# EAGLE design main_board_without_pads (EAGLE 9.5.1)
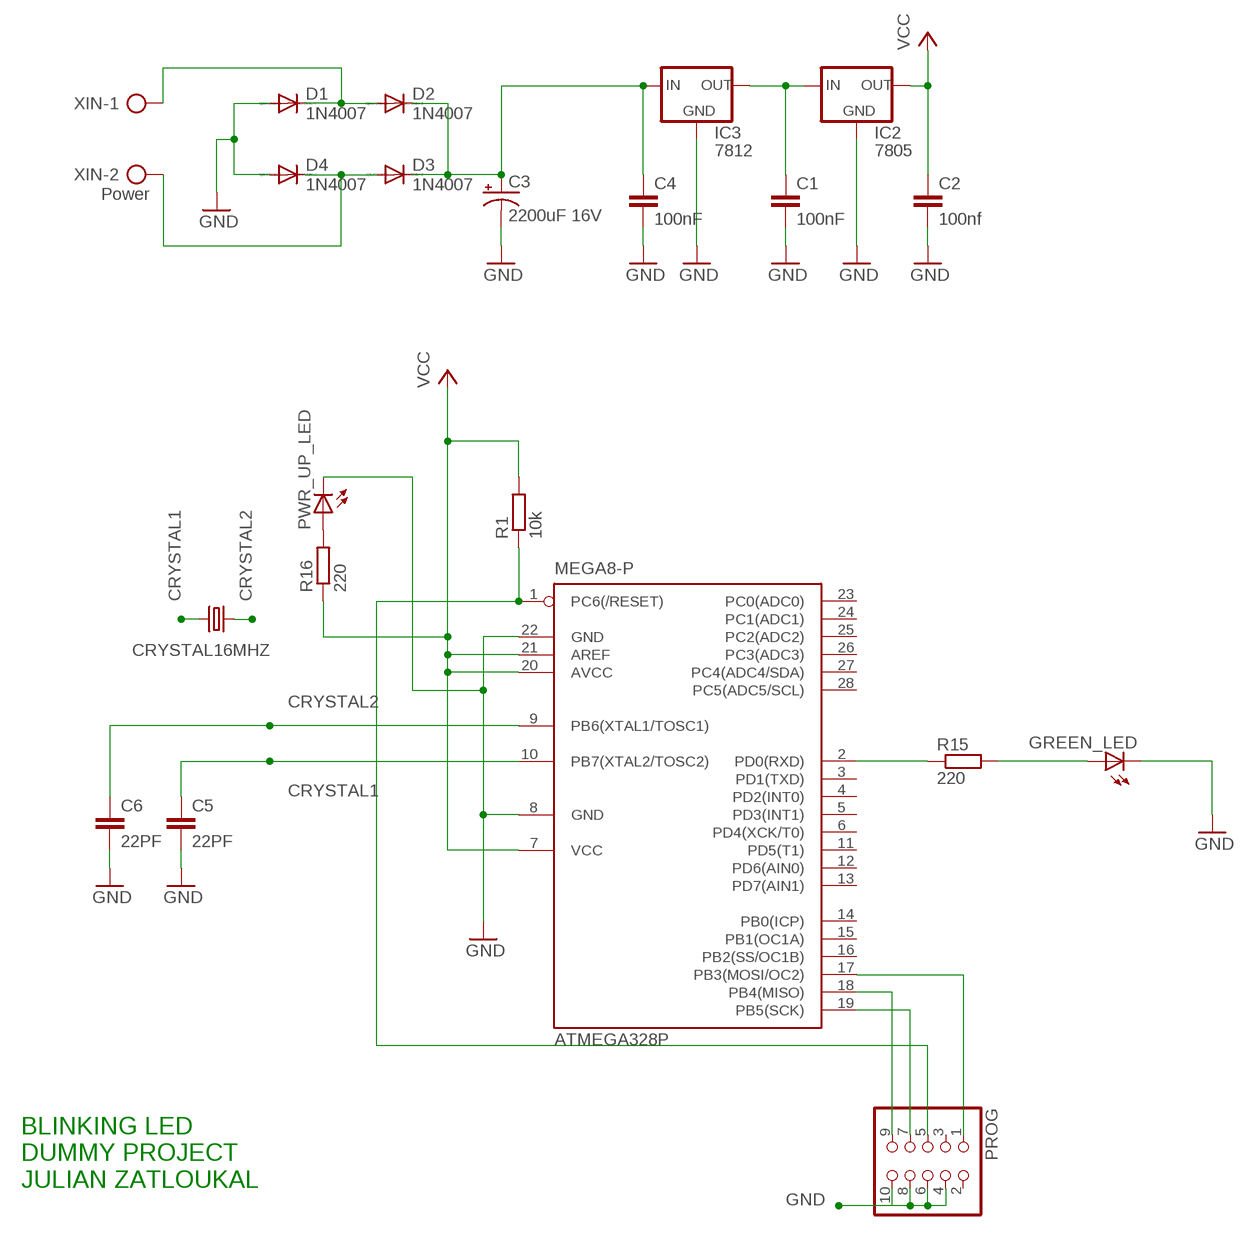
[diagram p0: schematic, sheet 1]

## Parts
ATMEGA328P  MEGA8-P  [DIL28-3]
C1  100nF  C-EU050-025X075  [C050-025X075]
C2  100nf  C-EU050-025X075  [C050-025X075]
C3  2200uF 16V  CPOL-USE7.5-16  [E7,5-16]
C4  100nF  C-EU050-025X075  [C050-025X075]
C5  22PF  C-EU050-024X044  [C050-024X044]
C6  22PF  C-EU050-024X044  [C050-024X044]
CRYSTAL16MHZ  CRYSTALHC49S  [HC49/S]
D1  1N4007  1N4004  [DO41-10]
D2  1N4007  1N4004  [DO41-10]
D3  1N4007  1N4004  [DO41-10]
D4  1N4007  1N4004  [DO41-10]
GREEN_LED  LED5MM  [LED5MM]
IC2  7805  78XXL  [78XXL]
IC3  7812  78XXL  [78XXL]
PROG  PINHD-2X5  [2X05]
PWR_UP_LED  LED5MM  [LED5MM]
R1  10k  R-EU_0207/10  [0207/10]
R15  220  R-EU_0207/10  [0207/10]
R16  220  R-EU_0207/10  [0207/10]
XIN  Power  AK500/2  [AK500/2]

## Nets
+12V: C1.1 IC2.IN IC3.OUT
CRYSTAL1: ATMEGA328P.10(PB7(XTAL2/TOSC2)) C5.1 CRYSTAL16MHZ.2
CRYSTAL2: ATMEGA328P.9(PB6(XTAL1/TOSC1)) C6.1 CRYSTAL16MHZ.1
GND: ATMEGA328P.8(GND) ATMEGA328P.22(GND) C1.2 C2.2 C3.- C4.2 C5.2 C6.2 D1.A D4.A GREEN_LED.K(C) IC2.GND IC3.GND PROG.4 PROG.6 PROG.8 PROG.10 PWR_UP_LED.K(C)
N$1: ATMEGA328P.1(PC6(/RESET)) PROG.5 R1.1
N$2: ATMEGA328P.2(PD0(RXD)) R15.1
N$16: ATMEGA328P.17(PB3(MOSI/OC2)) PROG.1
N$17: PWR_UP_LED.A R16.2
N$18: ATMEGA328P.19(PB5(SCK)) PROG.7
N$19: ATMEGA328P.18(PB4(MISO)) PROG.9
N$22: C3.+ C4.1 D2.C D3.C IC3.IN
N$24: D1.C D2.A XIN.1
N$65: D3.A D4.C XIN.2
N$153: GREEN_LED.A R15.2
VCC: ATMEGA328P.7(VCC) ATMEGA328P.20(AVCC) ATMEGA328P.21(AREF) C2.1 IC2.OUT R1.2 R16.1
Unconnected: ATMEGA328P.3(PD1(TXD)) ATMEGA328P.4(PD2(INT0)) ATMEGA328P.5(PD3(INT1)) ATMEGA328P.6(PD4(XCK/T0)) ATMEGA328P.11(PD5(T1)) ATMEGA328P.12(PD6(AIN0)) ATMEGA328P.13(PD7(AIN1)) ATMEGA328P.14(PB0(ICP)) ATMEGA328P.15(PB1(OC1A)) ATMEGA328P.16(PB2(SS/OC1B)) ATMEGA328P.23(PC0(ADC0)) ATMEGA328P.24(PC1(ADC1)) ATMEGA328P.25(PC2(ADC2)) ATMEGA328P.26(PC3(ADC3)) ATMEGA328P.27(PC4(ADC4/SDA)) ATMEGA328P.28(PC5(ADC5/SCL)) PROG.2 PROG.3

## Notes on the sheet
- BLINKING LED
  DUMMY PROJECT
  JULIAN ZATLOUKAL

## Library data of the parts
ATMEGA328P = atmel:MEGA8-P: MICROCONTROLLER 8 Kbytes FLASH, 1 kbytes SRAM, 512 bytes EEPROM, USART, 4-channel 10 bit ADC, 2-channel 8 bit ADC Pin compatible with Atmega48, ATMega88, ATMega168 Source: avr.lbr; OC_FARNELL: unknown; OC_NEWARK: unknown
C1 C2 C4-C6 = rcl:C-EU: CAPACITOR, European symbol
C3 = rcl:CPOL-US: POLARIZED CAPACITOR, American symbol
CRYSTAL16MHZ = crystal:CRYSTAL: CRYSTAL; OC_FARNELL: 1667008; OC_NEWARK: unknown
D1-D4 = diode:1N4004: DIODE general purpose rectifier, 1 A
GREEN_LED PWR_UP_LED = led:LED: LED OSRAM: - CHIPLED LG R971, LG N971, LY N971, LG Q971, LY Q971, LO R971, LY R971 LH N974, LH R974 LS Q976, LO Q976, LY Q976 LO Q996 - Hyper CHIPLED LW Q18S LB Q993, LB Q99A, LB R99A - SideLED LS A670, LO A670, LY A670, LG A670, LP A670 LB A673, LV A673, LT A673, LW A673 LH A674 LY A675 LS A676, LA A676, LO A676, LY A676, LW A676 LS A679, LY A679, LG A679 - Hyper Micro SIDELED® LS Y876, LA Y876, LO Y876, LY Y876 LT Y87S - SmartLED LW L88C, LW L88S LB L89C, LB L89S, LG L890 LS L89K, LO L89K, LY L89K LS L896, LA L896, LO L896, LY L896 - TOPLED LS T670, LO T670, LY T670, LG T670, LP T670 LSG T670, LSP T670, LSY T670, LOP T670, LYG T670 LG T671, LOG T671, LSG T671 LB T673, LV T673, LT T673, LW T673 LH T674 LS T676, LA T676, LO T676, LY T676, LB T676, LH T676, LSB T676, LW T676 LB T67C, LV T67C, LT T67C, LS T67K, LO T67K, LY T67K, LW E67C LS E67B, LA E67B, LO E67B, LY E67B, LB E67C, LV E67C, LT E67C LW T67C LS T679, LY T679, LG T679 LS T770, LO T770, LY T770, LG T770, LP T770 LB T773, LV T773, LT T773, LW T773 LH T774 LS E675, LA E675, LY E675, LS T675 LS T776, LA T776, LO T776, LY T776, LB T776 LHGB T686 LT T68C, LB T68C - Hyper Mini TOPLED® LB M676 - Mini TOPLED Santana® LG M470 LS M47K, LO M47K, LY M47K Source: http://www.osram.convergy.de LUXEON: - LUMILED® LXK2-PW12-R00, LXK2-PW12-S00, LXK2-PW14-U00, LXK2-PW14-V00 LXK2-PM12-R00, LXK2-PM12-S00, LXK2-PM14-U00 LXK2-PE12-Q00, LXK2-PE12-R00, LXK2-PE12-S00, LXK2-PE14-T00, LXK2-PE14-U00 LXK2-PB12-K00, LXK2-PB12-L00, LXK2-PB12-M00, LXK2-PB14-N00, LXK2-PB14-P00, LXK2-PB14-Q00 LXK2-PR12-L00, LXK2-PR12-M00, LXK2-PR14-Q00, LXK2-PR14-R00 LXK2-PD12-Q00, LXK2-PD12-R00, LXK2-PD12-S00 LXK2-PH12-R00, LXK2-PH12-S00 LXK2-PL12-P00, LXK2-PL12-Q00, LXK2-PL12-R00 Source: www.luxeon.com KINGBRIGHT: KA-3528ASYC Source: www.kingbright.com
IC2 IC3 = v-reg:78XXL: VOLTAGE REGULATOR
PROG = pinhead:PINHD-2X5: PIN HEADER
R1 R15 = rcl:R-EU_: RESISTOR, European symbol
R16 = rcl:R-EU_: RESISTOR, European symbol; SPICEPREFIX: R
XIN = con-ptr500:AK500/2: CONNECTOR; OC_FARNELL: unknown; OC_NEWARK: unknown

## Board
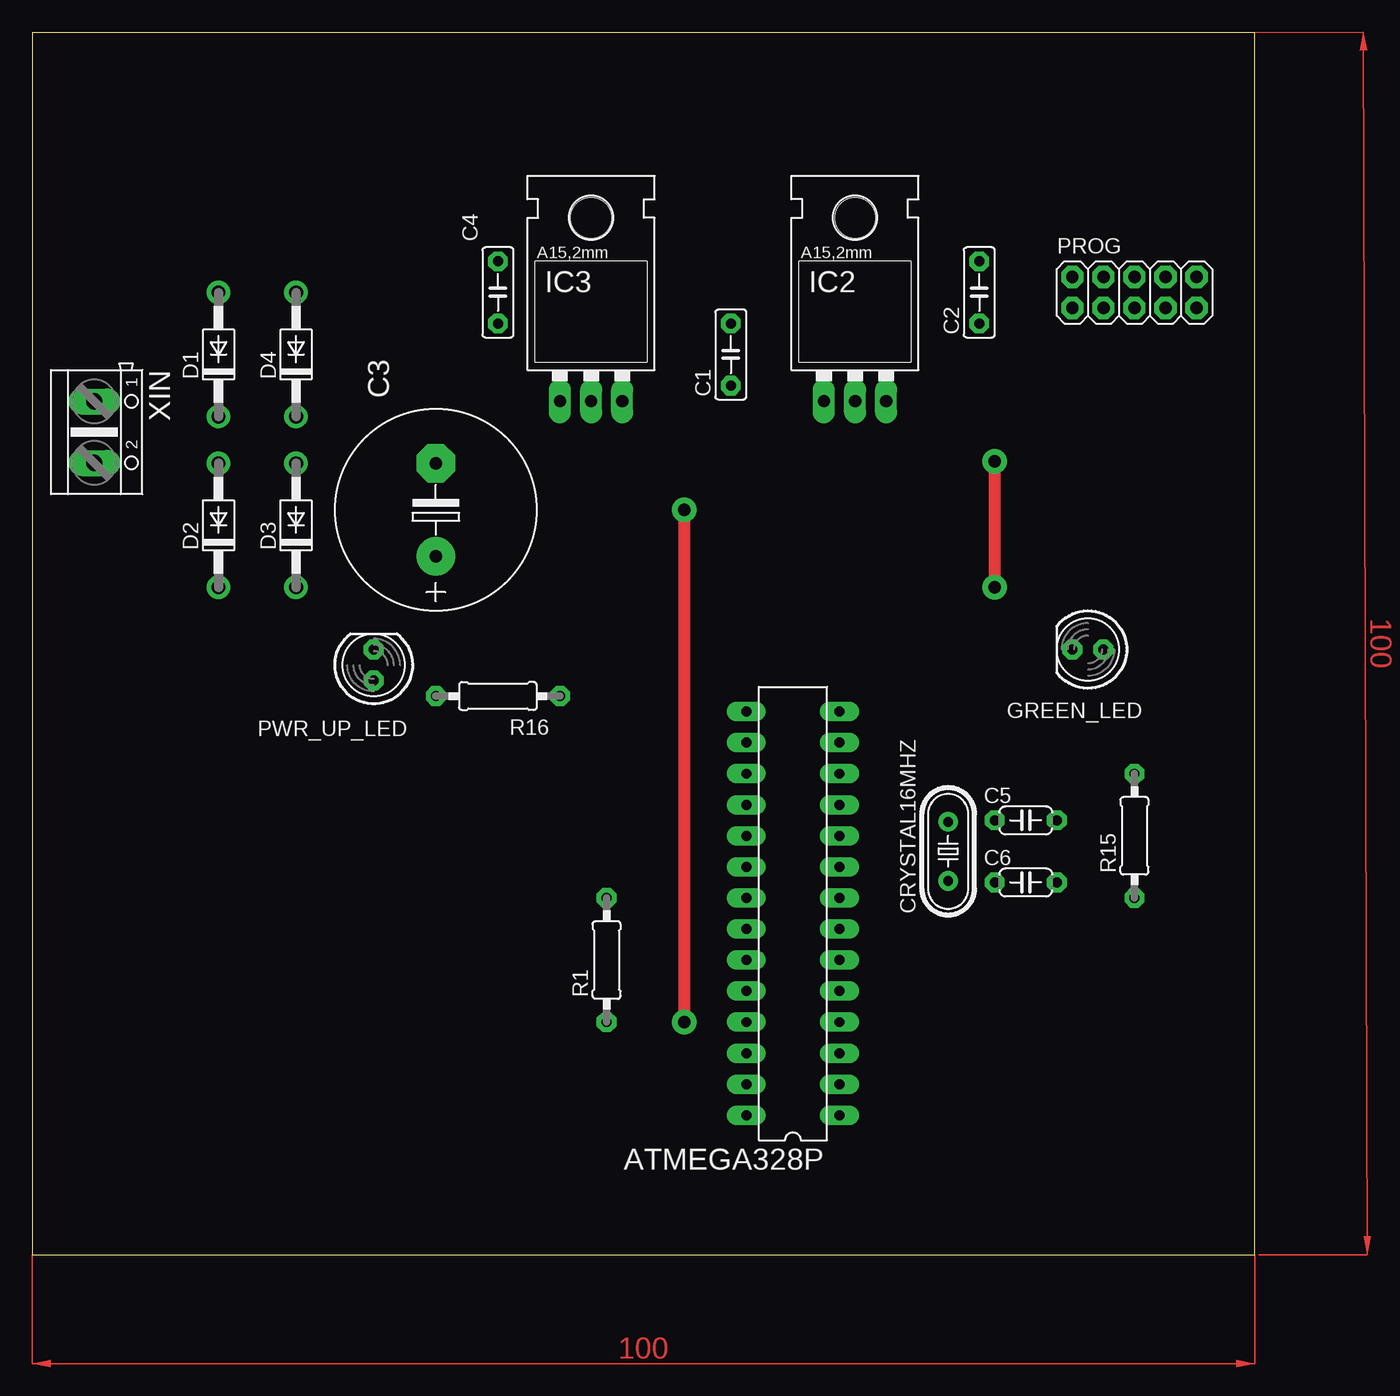
[diagram p1: board, top side]
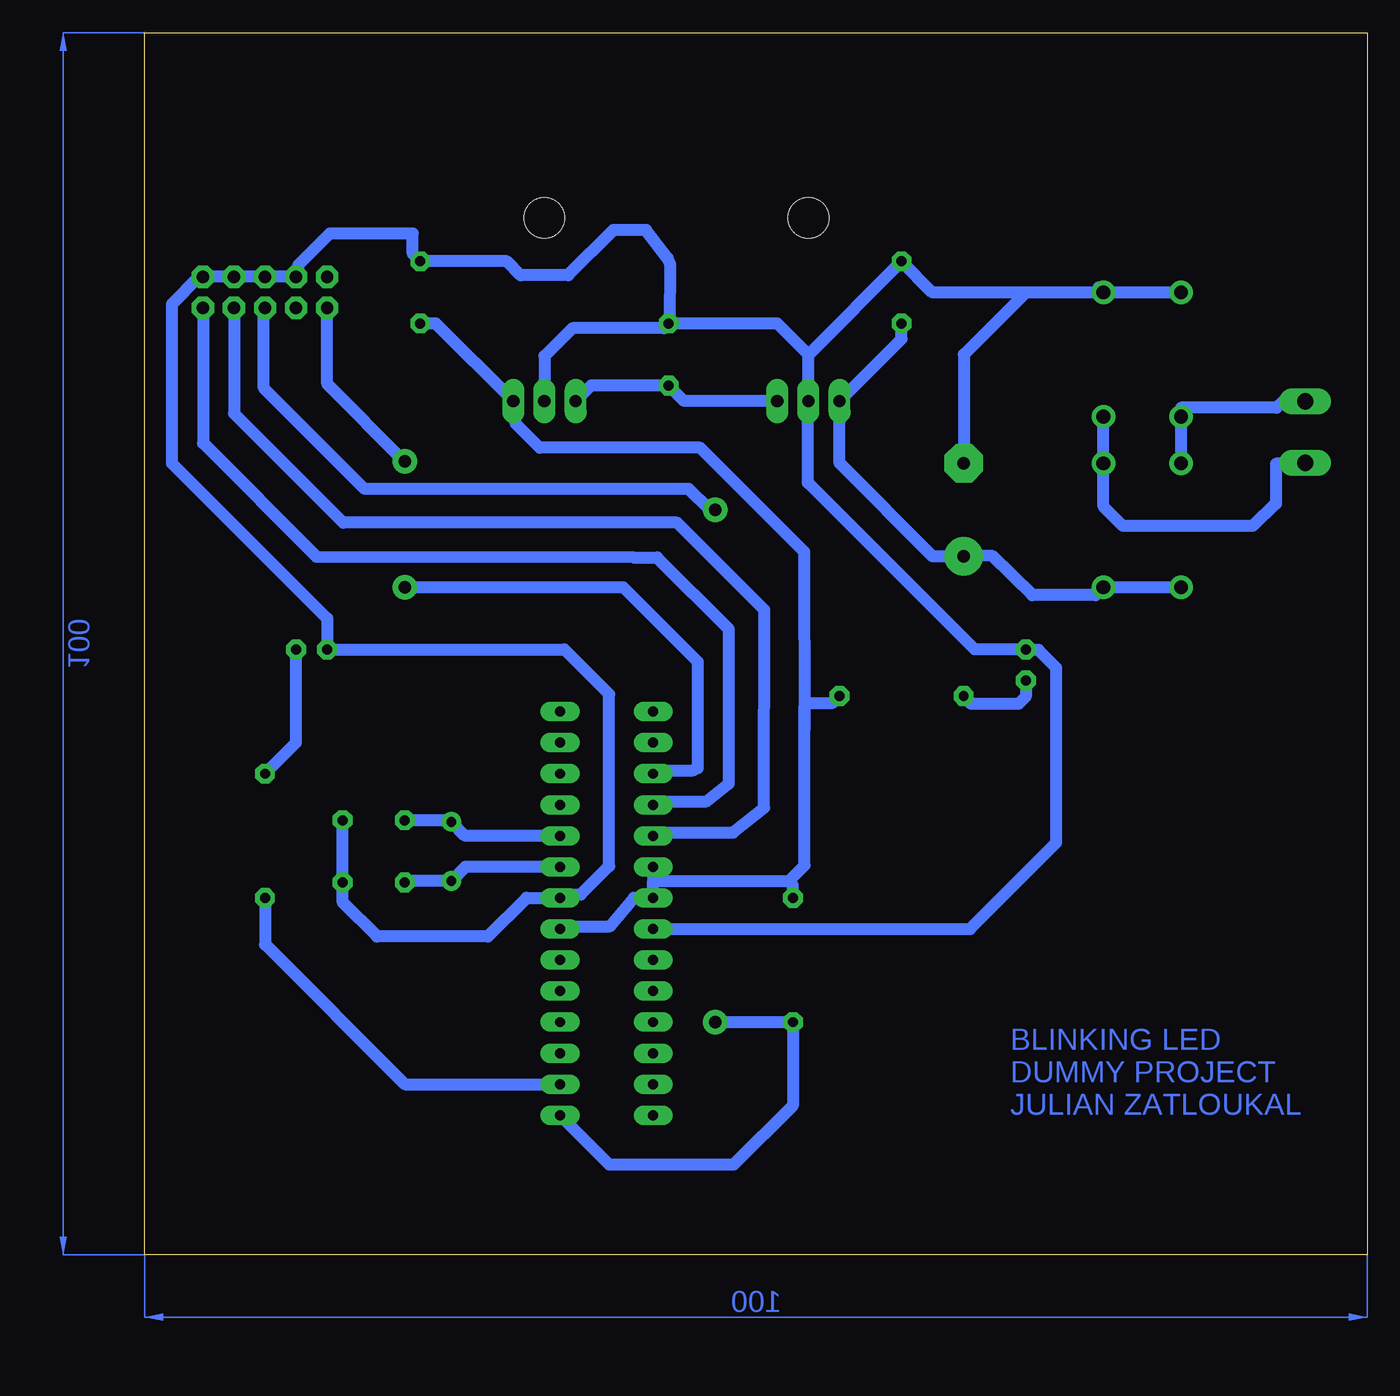
[diagram p2: board, bottom side, seen from below]

Size 100 x 100 mm. Coordinates in mm from the lower left corner, seen from the top.
Outline: 0,0 100,0 100,100 0,100 0,0
Copper layers (1*16): Top 0.035mm / dielectric 1.5mm / Bottom 0.035mm
Design rules "default *": minimum track width 10mil, minimum drill 1.25mm, track to track 1mm, track to pad 0.25mm, pad to pad 0.25mm, via to via 0.25mm, smd to smd 1mm, copper to edge 1mm, drill to drill 1mm, minimum pad ring 0.4mm, minimum via ring 0.5mm, stop-mask expansion 4mil, vias tented up to drill 0mil, thermal gap 10mil

### Footprints (pad centres in the part's own frame; a part is rotated, then mirrored left to right if it is on the bottom)
DIL28-3 = drill 0.813 long: 1 -16.51,-3.81; 2 -13.97,-3.81; 3 -11.43,-3.81; 4 -8.89,-3.81; 5 -6.35,-3.81; 6 -3.81,-3.81; 7 -1.27,-3.81; 8 1.27,-3.81; 9 3.81,-3.81; 10 6.35,-3.81; 11 8.89,-3.81; 12 11.43,-3.81; 13 13.97,-3.81; 14 16.51,-3.81; 15 16.51,3.81; 16 13.97,3.81; 17 11.43,3.81; 18 8.89,3.81; 19 6.35,3.81; 20 3.81,3.81; 21 1.27,3.81; 22 -1.27,3.81; 23 -3.81,3.81; 24 -6.35,3.81; 25 -8.89,3.81; 26 -11.43,3.81; 27 -13.97,3.81; 28 -16.51,3.81
C050-025X075 = drill 0.813 octagon: 1 -2.54,0; 2 2.54,0
E7,5-16 = drill 1.016 pad 3.15: + -3.81,0 | drill 1.016 pad 3.15 octagon: - 3.81,0
C050-024X044 = drill 0.813 octagon: 1 -2.54,0; 2 2.54,0
HC49/S = drill 0.813: 1 -2.413,0; 2 2.413,0
DO41-10 = drill 1.118: A 5.08,0; C -5.08,0
LED5MM = drill 0.813 octagon: A -1.27,0; K 1.27,0
78XXL = drill 1.016 long: GND 0,-3.81; IN -2.54,-3.81; OUT 2.54,-3.81 | hole 3.302: 0,11.176
2X05 = drill 1.016 octagon: 1 -5.08,-1.27; 2 -5.08,1.27; 3 -2.54,-1.27; 4 -2.54,1.27; 5 0,-1.27; 6 0,1.27; 7 2.54,-1.27; 8 2.54,1.27; 9 5.08,-1.27; 10 5.08,1.27
0207/10 = drill 0.813 octagon: 1 -5.08,0; 2 5.08,0
AK500/2 = drill 1.321 long: 1 -2.515,0; 2 2.515,0

### Placement (x,y rotation side)
ATMEGA328P  62.23,27.94 90 top
C1  57.15,73.66 90 top
C2  77.47,78.74 90 top
C3  33.02,60.96 90 top
C4  38.1,78.74 90 top
C5  81.28,35.56 0 top
C6  81.28,30.48 0 top
CRYSTAL16MHZ  74.93,33.02 90 top
D1  15.24,73.66 90 top
D2  15.24,59.69 90 top
D3  21.59,59.69 90 top
D4  21.59,73.66 90 top
GREEN_LED  86.36,49.53 180 top
IC2  67.31,73.66 0 top
IC3  45.72,73.66 0 top
PROG  90.17,78.74 0 top
PWR_UP_LED  27.94,48.26 90 top
R1  46.99,24.13 90 top
R15  90.17,34.29 90 top
R16  38.1,45.72 180 top
XIN  5.08,67.31 270 top

### Tracks (layer width: path | path; a pad name or v marks a point on that pad's centre or on a via)
+12V
  Bottom 1: IC3.OUT 55.88,69.85 C1.1 63.5,71.12 IC2.IN
CRYSTAL1
  Bottom 1: 78.48,35.82 C5.1 75.06,35.56 CRYSTAL16MHZ.2 73.79,34.29 ATMEGA328P.10
CRYSTAL2
  Bottom 1: ATMEGA328P.9 73.79,31.75 CRYSTAL16MHZ.1 78.61,30.61 C6.1
GND
  Bottom 1: D1.A D4.A | D4.A 21.98,79.13 | ATMEGA328P.8 65.95,29.36 | IC3.GND 45.76,69.49 45.76,63.17 32.12,49.53 PWR_UP_LED.K 27.9,49.49 26.9,49.49 25.44,48.03 25.44,33.73 32.5,26.67 ATMEGA328P.22 | C1.2 57.03,76.22 57.01,81.04 57.24,81.56 58.99,83.84 61.67,83.84 65.37,80.14 69.25,80.14 70.39,81.28 C2.2 78.08,81.89 78.08,83.56 84.88,83.56 87.45,80.99 87.45,80.19 PROG.4 PROG.6 PROG.8 PROG.10 95.54,80.01 97.79,77.76 97.79,64.77 85.09,52.07 GREEN_LED.K 65.67,49.53 62.02,45.88 62.02,31.81 64.34,29.49 65.76,29.49 ATMEGA328P.8 | C1.2 57.54,75.81 65.03,75.81 67.31,73.53 IC2.GND | ATMEGA328P.8 68.78,29.22 71.96,26.04 81.02,26.04 83.82,28.84 C6.2 C5.2 | 46.05,69.52 IC3.GND | 27.94,78.74 33.02,73.66 C3.- | D4.A 27.94,78.74 | 27.94,78.74 35.56,78.74 C4.2 45.72,73.66 | IC3.GND 45.72,73.66 | 45.72,73.66 48.26,76.2 C1.2
N$1  (via drill 1, 1 pad 1.2)
  Top 1: v53.34,60.96 v53.34,19.05
  Bottom 1: v53.34,60.96 53.81,60.96 55.52,62.67 82.02,62.67 90.27,70.92 90.27,77.37 PROG.5 | ATMEGA328P.1 61.99,7.38 51.83,7.38 46.99,12.22 R1.1 v53.34,19.05
N$2
  Bottom 1: R15.1 90.17,25.4 78.74,13.97 ATMEGA328P.2
N$16  (via drill 1)
  Top 1: v78.74,54.61 v78.74,64.92
  Bottom 1: v78.74,54.61 60.86,54.61 54.78,48.53 54.78,39.82 55.25,39.6 58.19,39.6 ATMEGA328P.17 | v78.74,64.92 85.09,71.27 PROG.1
N$17
  Bottom 1: PWR_UP_LED.A 27.94,45.68 28.53,45.09 32.39,45.09 R16.2
N$18
  Bottom 1: ATMEGA328P.19 58.15,34.56 51.88,34.56 49.34,36.58 49.32,52.76 56.46,59.9 83.77,59.9 92.71,68.84 PROG.7
N$19
  Bottom 1: ATMEGA328P.18 58.15,37.1 54.05,37.1 52.23,38.57 52.22,51.2 58.09,57.07 60.06,57.07 85.96,57.11 95.25,66.4 PROG.9
N$22
  Bottom 1: D2.C D3.C 22.23,53.97 27.42,53.97 30.73,57.21 C3.+ | C3.+ 33.02,57.42 | C3.+ 35.56,57.15 43.18,64.77 IC3.IN 38.1,74.93 C4.1
N$24
  Bottom 1: XIN.1 6.92,69.82 7.43,69.3 15.24,69.3 D1.C | 14.91,68.58 D1.C | D1.C D2.A
N$65
  Bottom 1: XIN.2 7.48,64.72 7.48,61.45 9.39,59.63 19.98,59.63 21.59,61.24 D3.A D4.C
N$153
  Bottom 1: R15.2 87.63,41.91 GREEN_LED.A
VCC
  Bottom 1: 58.42,30.6 ATMEGA328P.21 60,29.21 61.93,26.89 65.82,26.89 ATMEGA328P.7 | 46.04,43.04 46.08,57.54 54.58,66.04 67.71,66.04 69.67,68.01 69.67,69.67 IC2.OUT 76.2,76.2 C2.1 | ATMEGA328P.20 58.42,30.6 | 58.42,30.6 47.32,30.59 | 47.32,30.59 46.04,31.87 46.04,43.04 | 46.04,43.04 46.04,44.9 45.77,45.17 43.73,45.17 R16.1 | R1.2 46.99,30.26 47.32,30.59
(copper drawn outside any net)
  shapes: Bottom area x2, Top area x2

### Text on the board
Bottom: BLINKING LED / DUMMY PROJECT / JULIAN ZATLOUKAL